# EAGLE design Pow-OR v13-SFE-Pi (EAGLE 6.5.0)
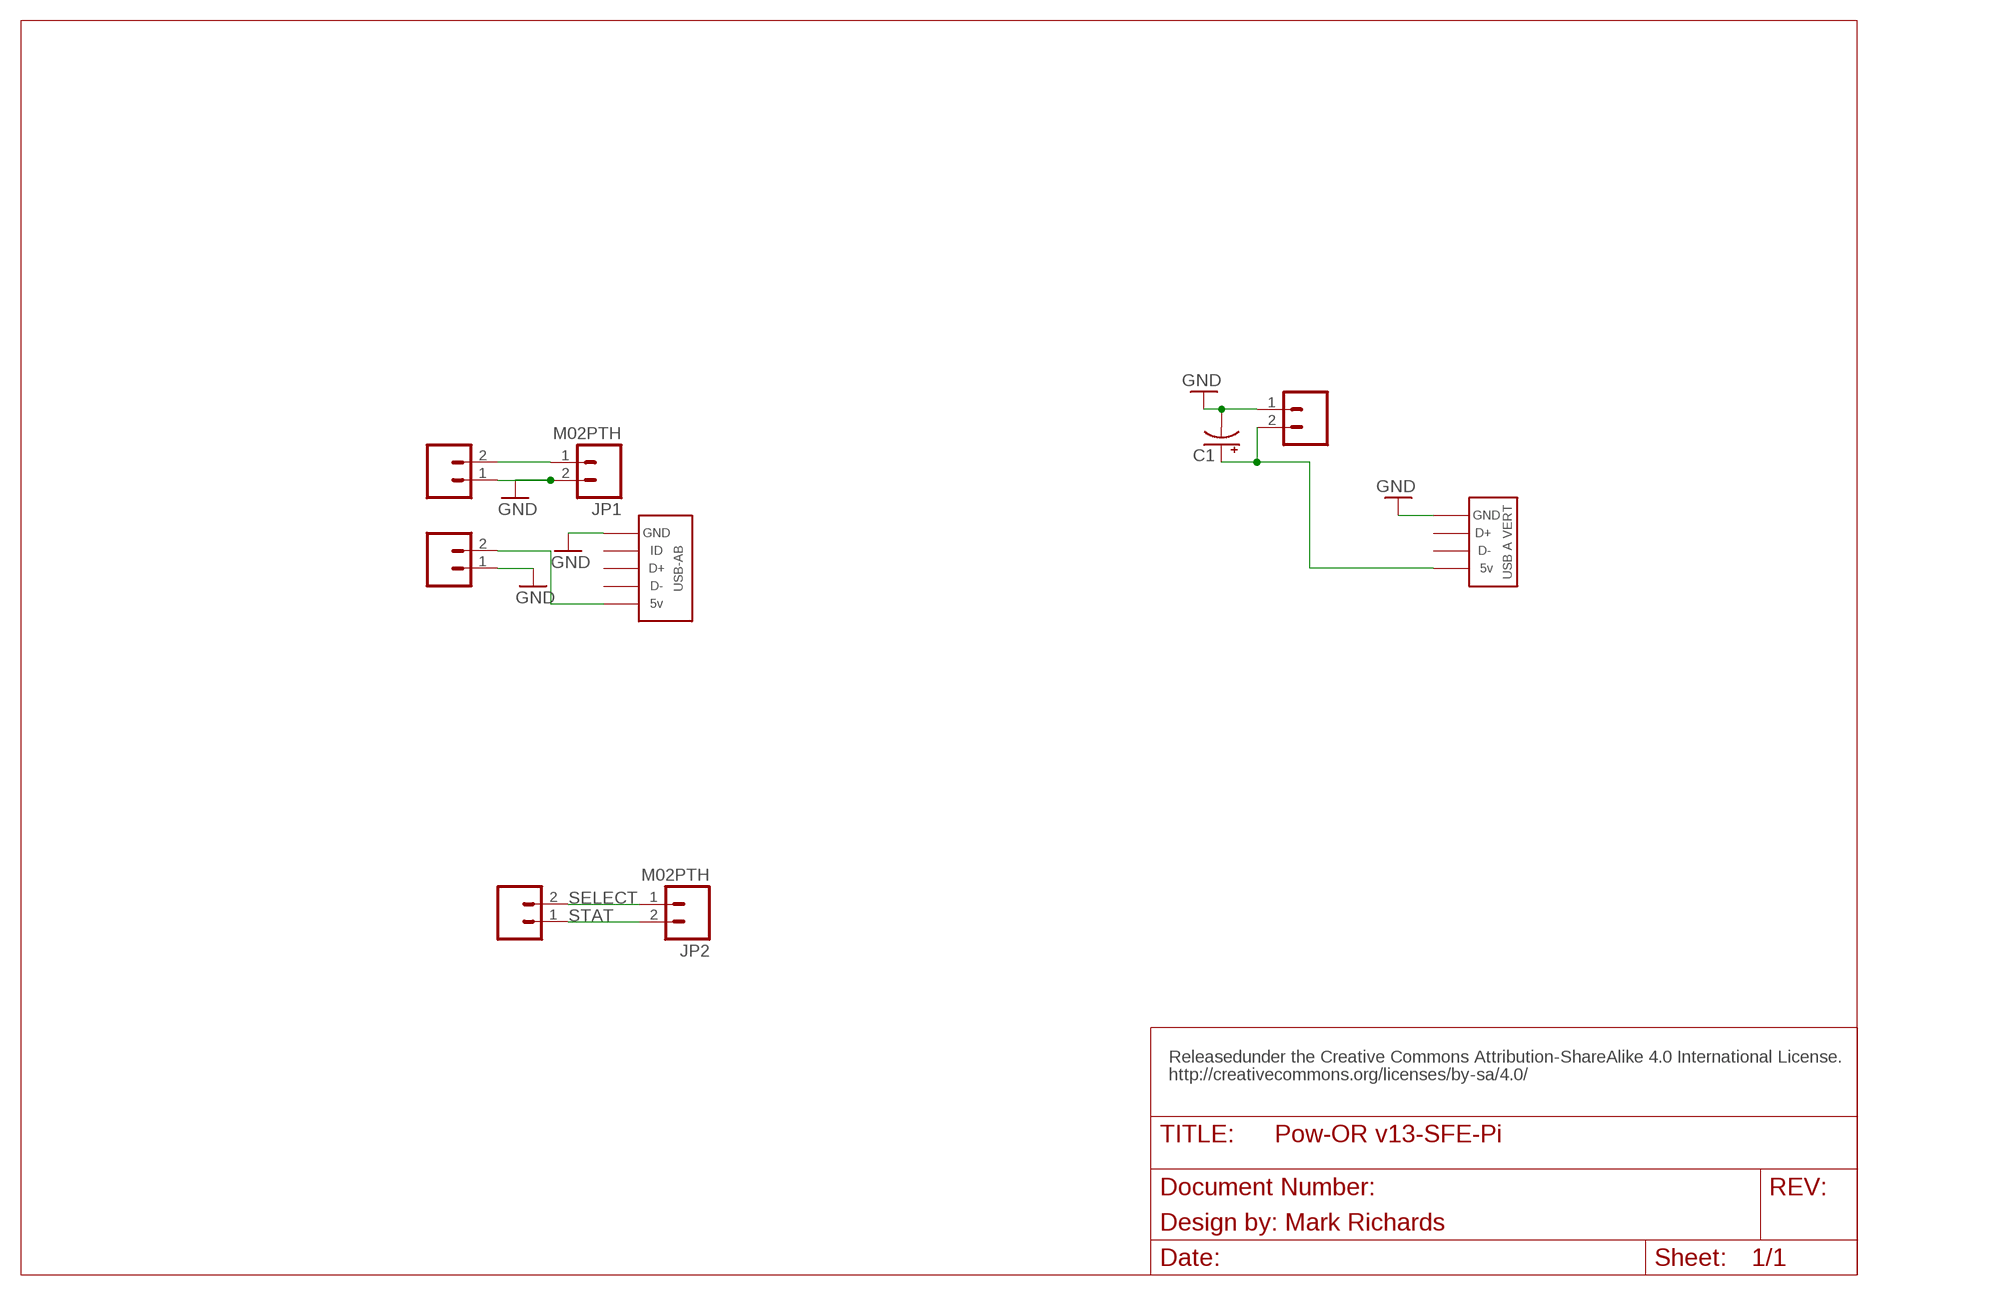
[diagram p0: schematic, sheet 1]

## Parts
C1  CAP_POLPTH1  [CPOL-RADIAL-100UF-25V]
JP1  M02PTH  [1X02]
JP2  M02PTH  [1X02]
JP3  M021X02_NO_SILK  [1X02_NO_SILK]
JP4  M021X02_NO_SILK  [1X02_NO_SILK]
JP5  M021X02_NO_SILK  [1X02_NO_SILK]
JP6  M021X02_NO_SILK  [1X02_NO_SILK]
U$1  USB-AB  [USB-AB]
U$2  USBA-VERT  [USBA-VERT]

## Nets
GND: C1.2(-) JP1.2 JP3.1 JP4.1 JP6.1 U$1.G U$2.NEG(GND)
IN1: JP1.1 JP3.2
N$1: JP4.2 U$1.V
OUT: C1.1(+) JP6.2 U$2.VCC
SELECT: JP2.1 JP5.2
STAT: JP2.2 JP5.1
Unconnected: U$1.D+ U$1.D- U$1.ID U$2.D+ U$2.D-

## Notes on the sheet
- Releasedunder the Creative Commons Attribution-ShareAlike 4.0 International License.
- http://creativecommons.org/licenses/by-sa/4.0/
- Design by: Mark Richards

## Library data of the parts
C1 = SparkFun-Passives:CAP_POL: Capacitor Polarized These are standard SMD and PTH capacitors. Normally 10uF, 47uF, and 100uF in electrolytic and tantalum varieties. Always verify the external diameter of the through hole cap, it varies with capacity, voltage, and manufacturer. The EIA devices should be standard.
JP1-JP6 = SparkFun-Connectors:M02: Standard 2-pin 0.1" header. Use with - straight break away headers ( PRT-00116) - right angle break away headers (PRT-00553) - swiss pins (PRT-00743) - machine pins (PRT-00117) - female headers (PRT-00115) Molex polarized connector foot print use with: PRT-08233 with associated crimp pins and housings. 2.54_SCREWTERM for use with PRT-10571. 3.5mm Screw Terminal footprints for PRT-08084 5mm Screw Terminal footprints for use with PRT-08433
U$1 = Richards:USB-AB
U$2 = Richards:USBA-VERT

## Board
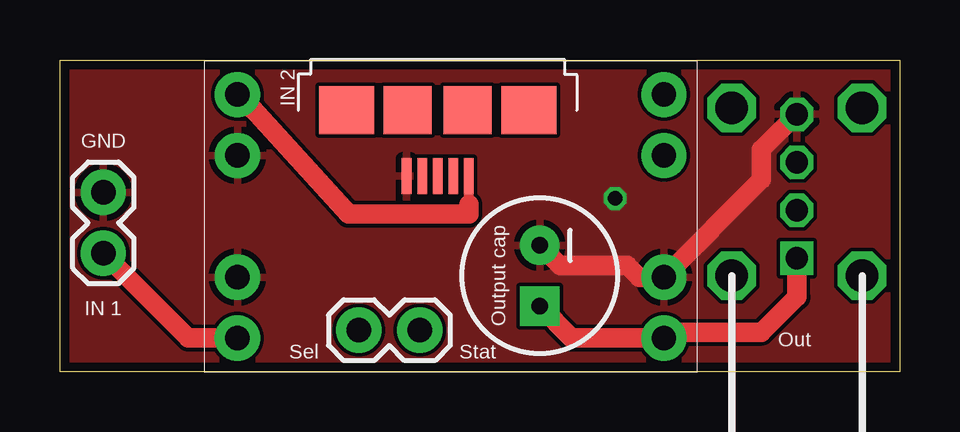
[diagram p1: board, top side]
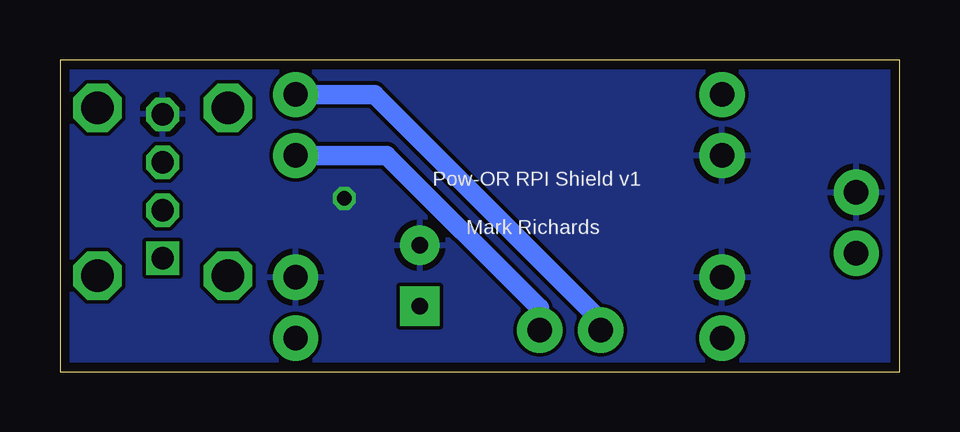
[diagram p2: board, bottom side, seen from below]

Size 35 x 13 mm. Coordinates in mm from the lower left corner, seen from the top.
Outline: 35,0 0,0 0,13 35,13 35,0
Copper layers (1*16): Top 0.0356mm / dielectric 1.5011mm / Bottom 0.0356mm
Design rules "LaenPCBOrder": minimum track width 6mil, minimum drill 13mil, track to track 6mil, track to pad 6mil, pad to pad 6mil, via to via 6mil, smd to smd 6mil, copper to edge 15mil, drill to drill 6mil, minimum pad ring 7mil, minimum via ring 7mil, stop-mask expansion 3mil, vias tented up to drill 0mil, thermal gap 10mil

### Footprints (pad centres in the part's own frame; a part is rotated, then mirrored left to right if it is on the bottom)
CPOL-RADIAL-100UF-25V = drill 0.7 pad 1.651 square: 1 1.27,0 | drill 0.7 pad 1.651: 2 -1.27,0
1X02 = drill 1.016 pad 1.88: 1 0,0; 2 2.54,0
1X02_NO_SILK = drill 1.016 pad 1.88: 1 0,0; 2 2.54,0
USB-AB = smd 0.4 x 1.5: D+ 0,2.75; D- -0.65,2.75; G 1.3,2.75; ID 0.65,2.75; V -1.3,2.75 | smd 2.3 x 2: P$2 -3.8,0; P$3 3.8,0 | smd 2 x 2: P$5 1.25,0; P$6 -1.25,0
USBA-VERT = drill 0.92 octagon: D+ 2.72,4.73; D- 2.72,2.73; NEG 2.72,6.73 | drill 1.35 octagon: P$2 0,0; P$3 5.44,0; P$4 0,7; P$5 5.44,7 | drill 0.92 square: VCC 2.72,0.73

### Placement (x,y rotation side)
C1  20,4 270 top
JP1  1.81,4.94 90 top
JP2  12.46,1.73 0 top
JP3  7.4,3.94 270 top
JP4  7.4,9.02 90 top
JP5  25.18,9.02 90 top
JP6  25.18,3.94 270 top
U$1  15.75,10.9 180 top
U$2  28,4 0 top

### Tracks (layer width: path | path; a pad name or v marks a point on that pad's centre or on a via)
GND  (via drill 0.6)
  Top 0.813: C1.2 20.84,4.43 23.65,4.43 24.15,3.94 JP6.1 29.24,8 29.24,9.26 U$2.NEG
  other vias: 23.15,7.22
  pour Bottom: 0.03,14.11 0.03,0.08 34.93,0.08 34.93,14.11
  pour Top: 0.03,14.08 0.03,0.11 35.08,0.11 35.08,14.08
IN1
  Top 0.813: JP1.1 5.35,1.4 JP3.2
N$1
  Top 0.406: 17.05,6.97 U$1.V
  Top 0.813: JP4.2 7.95,11 8,11 12.03,6.57 17.05,6.57 17.05,6.97
OUT
  Top 0.813: C1.1 21.33,1.4 JP6.2 25.42,1.64 29.24,1.64 30.72,3.11 U$2.VCC
SELECT
  Bottom 0.813: JP5.2 21.89,11.56 12.48,2.14 12.48,1.75 JP2.1
STAT
  Bottom 0.813: JP5.1 21.38,9.02 15.02,2.65 15.02,1.75 JP2.2

### Text on the board
tPlace: IN 2 | GND | IN 1 | Output cap | Sel | Stat | Out
bPlace: Pow-OR RPI Shield v1 | Mark Richards